# EAGLE design untitled (EAGLE 7.2.0)
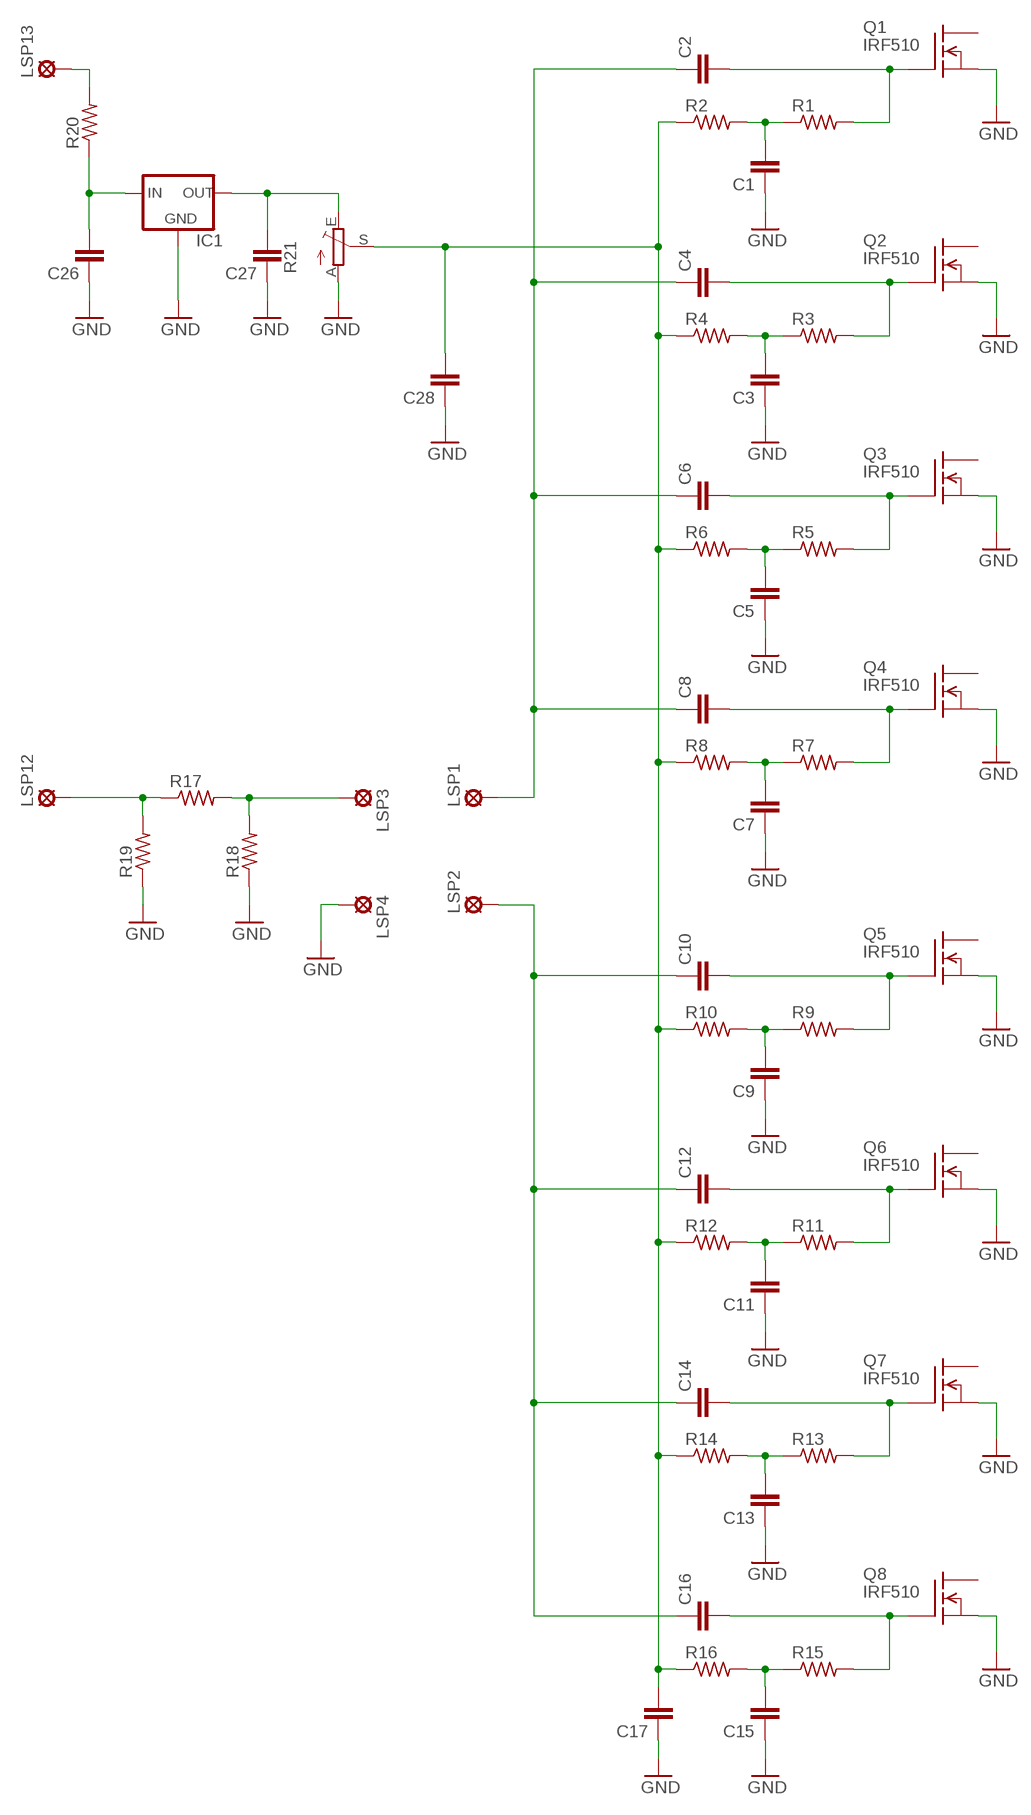
[diagram p0: schematic, sheet 1]

## Parts
C1  C-EU075-032X103  [C075-032X103]
C2  C-EU075-032X103  [C075-032X103]
C3  C-EU075-032X103  [C075-032X103]
C4  C-EU075-032X103  [C075-032X103]
C5  C-EU075-032X103  [C075-032X103]
C6  C-EU075-032X103  [C075-032X103]
C7  C-EU075-032X103  [C075-032X103]
C8  C-EU075-032X103  [C075-032X103]
C9  C-EU075-032X103  [C075-032X103]
C10  C-EU075-032X103  [C075-032X103]
C11  C-EU075-032X103  [C075-032X103]
C12  C-EU075-032X103  [C075-032X103]
C13  C-EU075-032X103  [C075-032X103]
C14  C-EU075-032X103  [C075-032X103]
C15  C-EU075-032X103  [C075-032X103]
C16  C-EU075-032X103  [C075-032X103]
C17  C-EU075-032X103  [C075-032X103]
C26  C-EU075-032X103  [C075-032X103]
C27  C-EU075-032X103  [C075-032X103]
C28  C-EU075-032X103  [C075-032X103]
IC1  78XXS  [78XXS]
LSP1  SE14  [SE14]
LSP2  SE14  [SE14]
LSP3  SE14  [SE14]
LSP4  SE14  [SE14]
LSP12  SE14  [SE14]
LSP13  SE14  [SE14]
Q1  IRF510  [TO220]
Q2  IRF510  [TO220]
Q3  IRF510  [TO220]
Q4  IRF510  [TO220]
Q5  IRF510  [TO220]
Q6  IRF510  [TO220]
Q7  IRF510  [TO220]
Q8  IRF510  [TO220]
R1  R-US_0309/12  [0309/12]
R2  R-US_0309/12  [0309/12]
R3  R-US_0309/12  [0309/12]
R4  R-US_0309/12  [0309/12]
R5  R-US_0309/12  [0309/12]
R6  R-US_0309/12  [0309/12]
R7  R-US_0309/12  [0309/12]
R8  R-US_0309/12  [0309/12]
R9  R-US_0309/12  [0309/12]
R10  R-US_0309/12  [0309/12]
R11  R-US_0309/12  [0309/12]
R12  R-US_0309/12  [0309/12]
R13  R-US_0309/12  [0309/12]
R14  R-US_0309/12  [0309/12]
R15  R-US_0309/12  [0309/12]
R16  R-US_0309/12  [0309/12]
R17  R-US_0309/12  [0309/12]
R18  R-US_0309/12  [0309/12]
R19  R-US_0309/12  [0309/12]
R20  R-US_0309/12  [0309/12]
R21  TRIM_EU-CA6V  [CA6V]

## Nets
GND: C1.1 C3.1 C5.1 C7.1 C9.1 C11.1 C13.1 C15.1 C17.1 C26.1 C27.1 C28.1 IC1.GND LSP4.MP Q1.3(S) Q2.3(S) Q3.3(S) Q4.3(S) Q5.3(S) Q6.3(S) Q7.3(S) Q8.3(S) R18.1 R19.1 R21.A
N$1: C2.2 Q1.1(G) R1.2
N$2: C1.2 R1.1 R2.2
N$3: C4.2 Q2.1(G) R3.2
N$4: C3.2 R3.1 R4.2
N$5: C6.2 Q3.1(G) R5.2
N$6: C5.2 R5.1 R6.2
N$7: C8.2 Q4.1(G) R7.2
N$8: C7.2 R7.1 R8.2
N$9: C10.2 Q5.1(G) R9.2
N$10: C9.2 R9.1 R10.2
N$11: C12.2 Q6.1(G) R11.2
N$12: C11.2 R11.1 R12.2
N$13: C14.2 Q7.1(G) R13.2
N$14: C13.2 R13.1 R14.2
N$15: C16.2 Q8.1(G) R15.2
N$16: C15.2 R15.1 R16.2
N$17: C17.2 C28.2 R2.1 R4.1 R6.1 R8.1 R10.1 R12.1 R14.1 R16.1 R21.S
N$20: C10.1 C12.1 C14.1 C16.1 LSP2.MP
N$21: C2.1 C4.1 C6.1 C8.1 LSP1.MP
N$27: LSP3.MP R17.2 R18.2
N$28: LSP12.MP R17.1 R19.2
N$30: C26.2 IC1.IN R20.1
N$31: LSP13.MP R20.2
N$32: C27.2 IC1.OUT R21.E
Unconnected: Q1.2(D) Q2.2(D) Q3.2(D) Q4.2(D) Q5.2(D) Q6.2(D) Q7.2(D) Q8.2(D)

## Library data of the parts
C1-C17 C26-C28 = resistor:C-EU: CAPACITOR, European symbol
IC1 = v-reg:78XXS: VOLTAGE REGULATOR
LSP1-LSP4 LSP12 LSP13 = solpad:SE14: SOLDER PAD E1553, drill 1,4mm, distributor Buerklin, 07F820
Q1-Q8 = transistor-fet:IRF510: N-Channel Enhancement MOSFET (HEXFET); 100V; 5,6A; 0,54Ohm
R1-R20 = resistor:R-US_: RESISTOR, American symbol
R21 = pot:TRIM_EU-: POTENTIOMETER

## Board
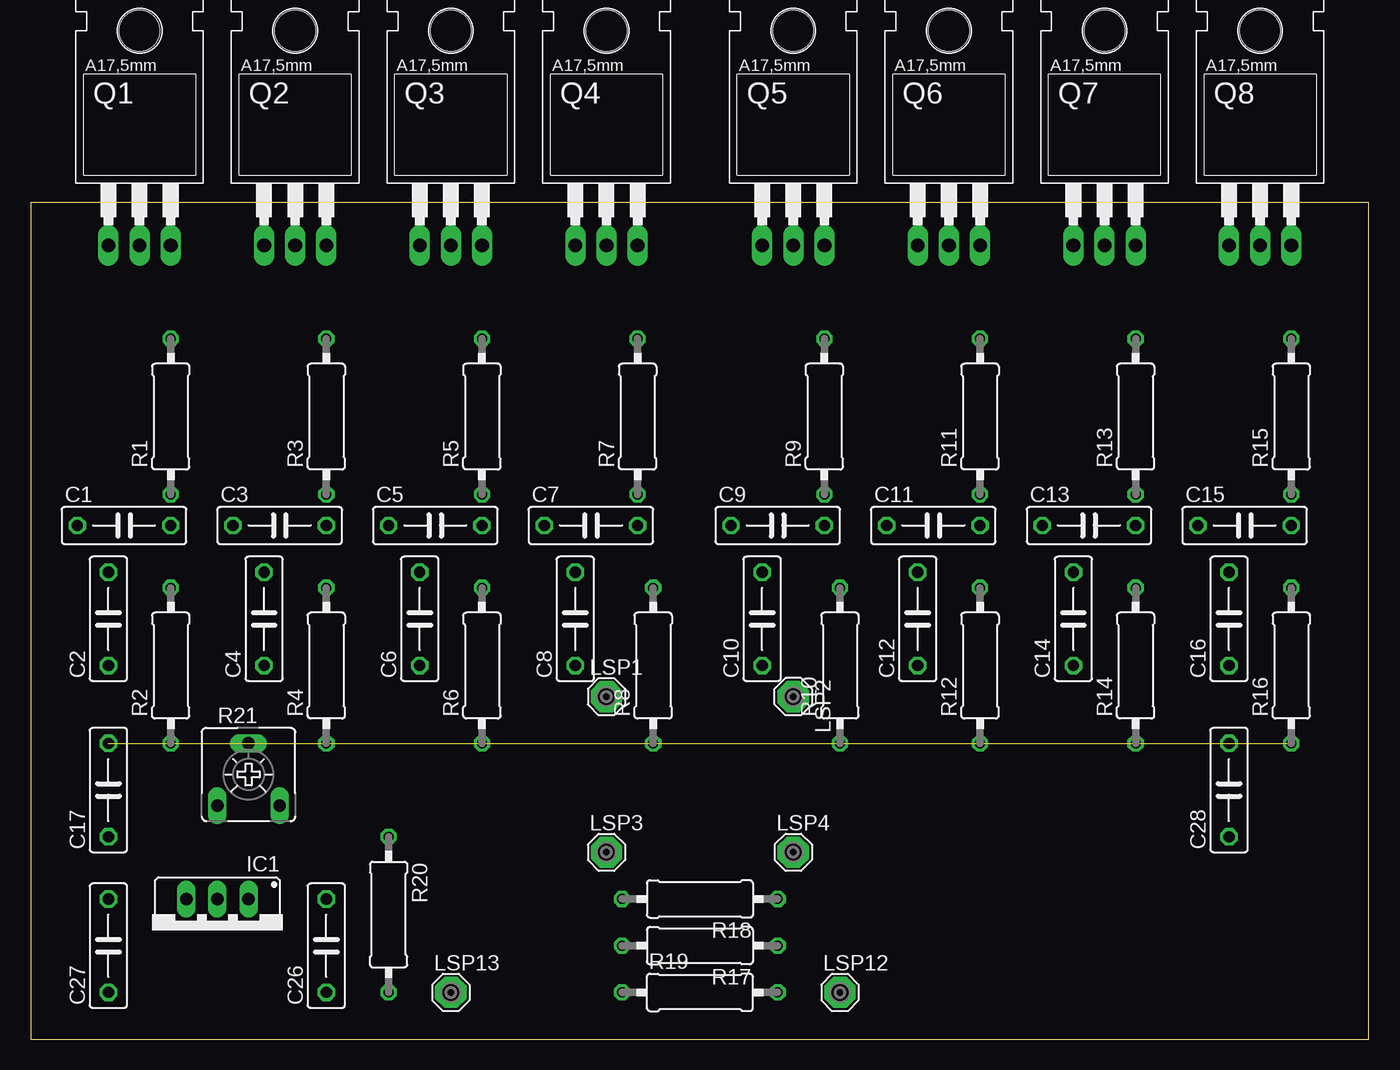
[diagram p1: board, top side]
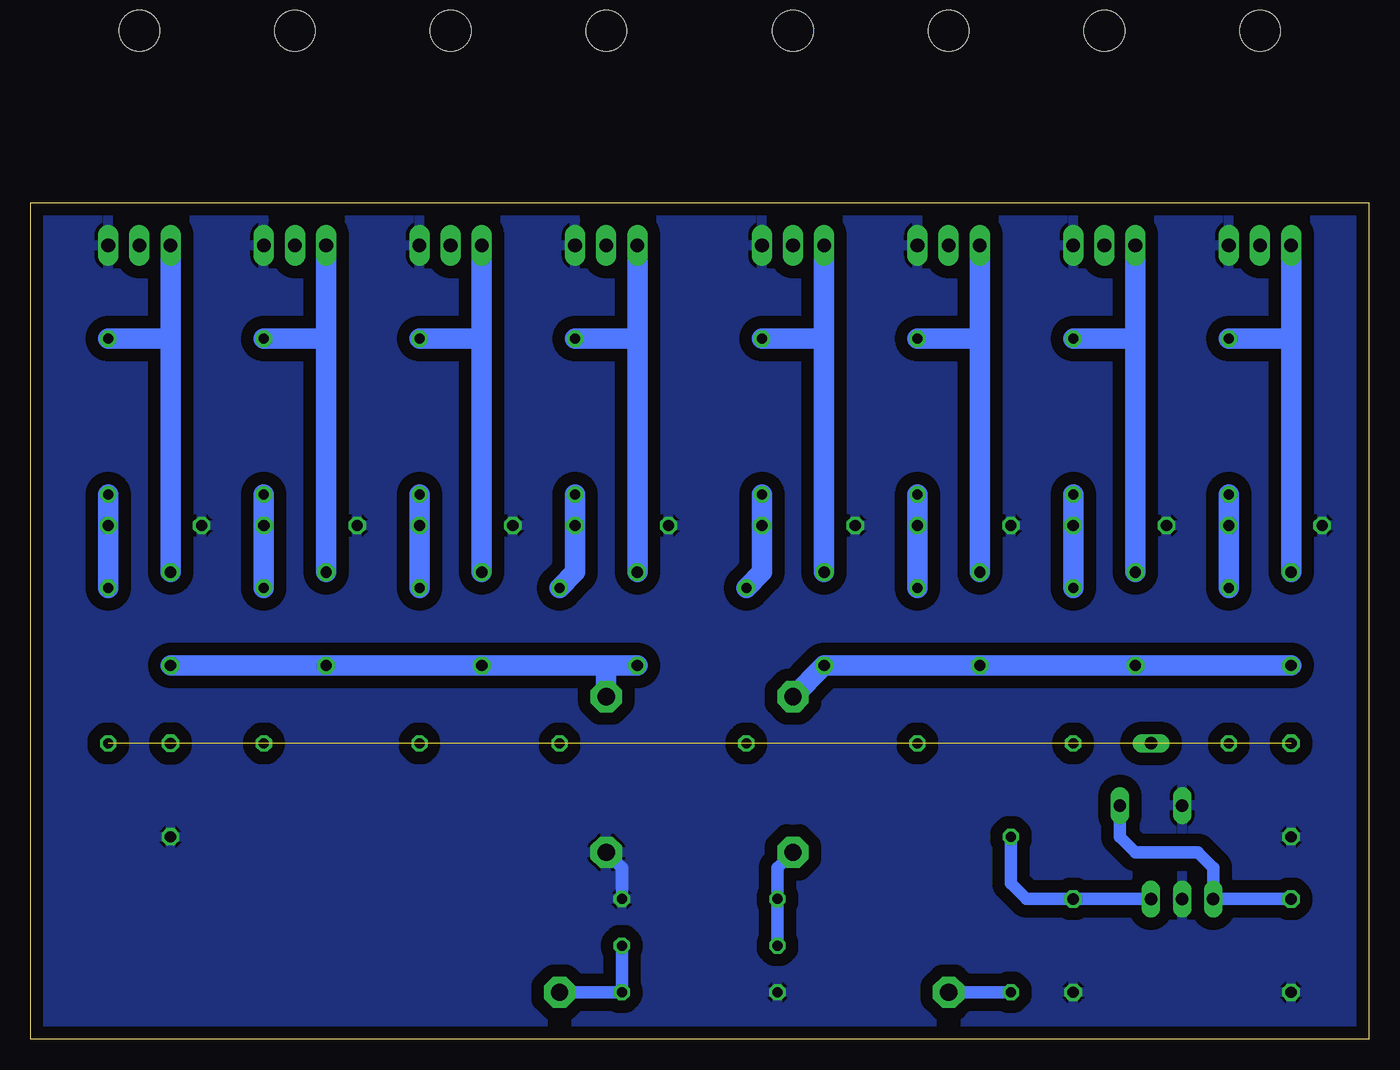
[diagram p2: board, bottom side, seen from below]

Size 109.2 x 68.25 mm. Coordinates in mm from the lower left corner, seen from the top.
Outline: 0,0 109.2,0 109.2,68.25 0,68.25 0,0
Copper layers (1*16): Top 0.035mm / dielectric 1.5mm / Bottom 0.035mm
Design rules "default": minimum track width 10mil, minimum drill 24mil, track to track 8mil, track to pad 8mil, pad to pad 8mil, via to via 8mil, smd to smd 8mil, copper to edge 40mil, drill to drill 8mil, minimum pad ring 10mil, minimum via ring 8mil, stop-mask expansion 4mil, vias tented up to drill 0mil, thermal gap 10mil

### Footprints (pad centres in the part's own frame; a part is rotated, then mirrored left to right if it is on the bottom)
C075-032X103 = drill 0.914 octagon: 1 -3.81,0; 2 3.81,0
78XXS = drill 1.016 long: GND 0,-2.54; IN -2.54,-2.54; OUT 2.54,-2.54
SE14 = drill 1.397 pad 2.54 octagon: MP 0,0
TO220 = drill 1.118 long: 1 -2.54,-6.35; 2 0,-6.35; 3 2.54,-6.35 | hole 3.302: 0,11.176
0309/12 = drill 0.813 octagon: 1 -6.35,0; 2 6.35,0
CA6V = drill 1.016 long: A -2.54,-2.54; E 2.54,-2.54; S 0,2.54

### Placement (x,y rotation side)
C1  7.62,41.91 0 top
C2  6.35,34.29 90 top
C3  20.32,41.91 0 top
C4  19.05,34.29 90 top
C5  33.02,41.91 0 top
C6  31.75,34.29 90 top
C7  45.72,41.91 0 top
C8  44.45,34.29 90 top
C9  60.96,41.91 0 top
C10  59.69,34.29 90 top
C11  73.66,41.91 0 top
C12  72.39,34.29 90 top
C13  86.36,41.91 0 top
C14  85.09,34.29 90 top
C15  99.06,41.91 0 top
C16  97.79,34.29 90 top
C17  6.35,20.32 90 top
C26  24.13,7.62 90 top
C27  6.35,7.62 90 top
C28  97.79,20.32 90 top
IC1  15.24,8.89 180 top
LSP1  46.99,27.94 0 top
LSP2  62.23,27.94 270 top
LSP3  46.99,15.24 0 top
LSP4  62.23,15.24 0 top
LSP12  66.04,3.81 0 top
LSP13  34.29,3.81 0 top
Q1  8.89,71.12 0 top
Q2  21.59,71.12 0 top
Q3  34.29,71.12 0 top
Q4  46.99,71.12 0 top
Q5  62.23,71.12 0 top
Q6  74.93,71.12 0 top
Q7  87.63,71.12 0 top
Q8  100.33,71.12 0 top
R1  11.43,50.8 90 top
R2  11.43,30.48 90 top
R3  24.13,50.8 90 top
R4  24.13,30.48 90 top
R5  36.83,50.8 90 top
R6  36.83,30.48 90 top
R7  49.53,50.8 90 top
R8  50.8,30.48 90 top
R9  64.77,50.8 90 top
R10  66.04,30.48 90 top
R11  77.47,50.8 90 top
R12  77.47,30.48 90 top
R13  90.17,50.8 90 top
R14  90.17,30.48 90 top
R15  102.87,50.8 90 top
R16  102.87,30.48 90 top
R17  54.61,7.62 180 top
R18  54.61,11.43 180 top
R19  54.61,3.81 0 top
R20  29.21,10.16 270 top
R21  17.78,21.59 0 top

### Tracks (layer width: path | path; a pad name or v marks a point on that pad's centre or on a via)
GND
  Bottom 1.016: LSP4.MP 60.96,13.97 R18.1
  pour Bottom (isolate 1.016): 0,68.58 109.22,68.58 109.22,0 0,0
N$1
  Bottom 1.676: Q1.1 6.35,57.15 | 6.35,57.15 C2.2 | R1.2 6.35,57.15
N$2
  Bottom 1.676: R1.1 C1.2 R2.2
N$3
  Bottom 1.676: Q2.1 19.05,57.15 | 19.05,57.15 C4.2 | R3.2 19.05,57.15
N$4
  Bottom 1.676: R3.1 C3.2 R4.2
N$5
  Bottom 1.676: Q3.1 31.75,57.15 | 31.75,57.15 C6.2 | R5.2 31.75,57.15
N$6
  Bottom 1.676: R5.1 C5.2 R6.2
N$7
  Bottom 1.676: Q4.1 44.45,57.15 | 44.45,57.15 C8.2 | R7.2 44.45,57.15
N$8
  Bottom 1.676: R7.1 C7.2 49.53,38.1 R8.2
N$9
  Bottom 1.676: Q5.1 59.69,57.15 | 59.69,57.15 C10.2 | R9.2 59.69,57.15
N$10
  Bottom 1.676: R9.1 C9.2 64.77,38.1 R10.2
N$11
  Bottom 1.676: Q6.1 72.39,57.15 | 72.39,57.15 C12.2 | R11.2 72.39,57.15
N$12
  Bottom 1.676: R11.1 C11.2 R12.2
N$13
  Bottom 1.676: Q7.1 85.09,57.15 | 85.09,57.15 C14.2 | R13.2 85.09,57.15
N$14
  Bottom 1.676: R13.1 C13.2 R14.2
N$15
  Bottom 1.676: Q8.1 97.79,57.15 | 97.79,57.15 C16.2 | R15.2 97.79,57.15
N$16
  Bottom 1.676: R15.1 C15.2 R16.2
N$17  (10 unrouted)
N$20
  Bottom 1.676: C16.1 C14.1 C12.1 62.23,30.48 | 62.23,30.48 C10.1 | LSP2.MP 62.23,30.48
N$21
  Bottom 1.676: C2.1 C4.1 C6.1 C8.1 LSP1.MP
N$27
  Bottom 1.016: LSP3.MP 48.26,13.97 R18.2 R17.2
N$28
  Bottom 1.016: R17.1 R19.2 LSP12.MP
N$30
  Bottom 1.016: IC1.IN C26.2 27.94,11.43 29.21,12.7 R20.1
N$31
  Bottom 1.016: R20.2 LSP13.MP
N$32
  Bottom 1.016: C27.2 IC1.OUT 12.7,13.97 13.97,15.24 19.05,15.24 20.32,16.51 R21.E